# EAGLE design RWatch (EAGLE 7.3.0)
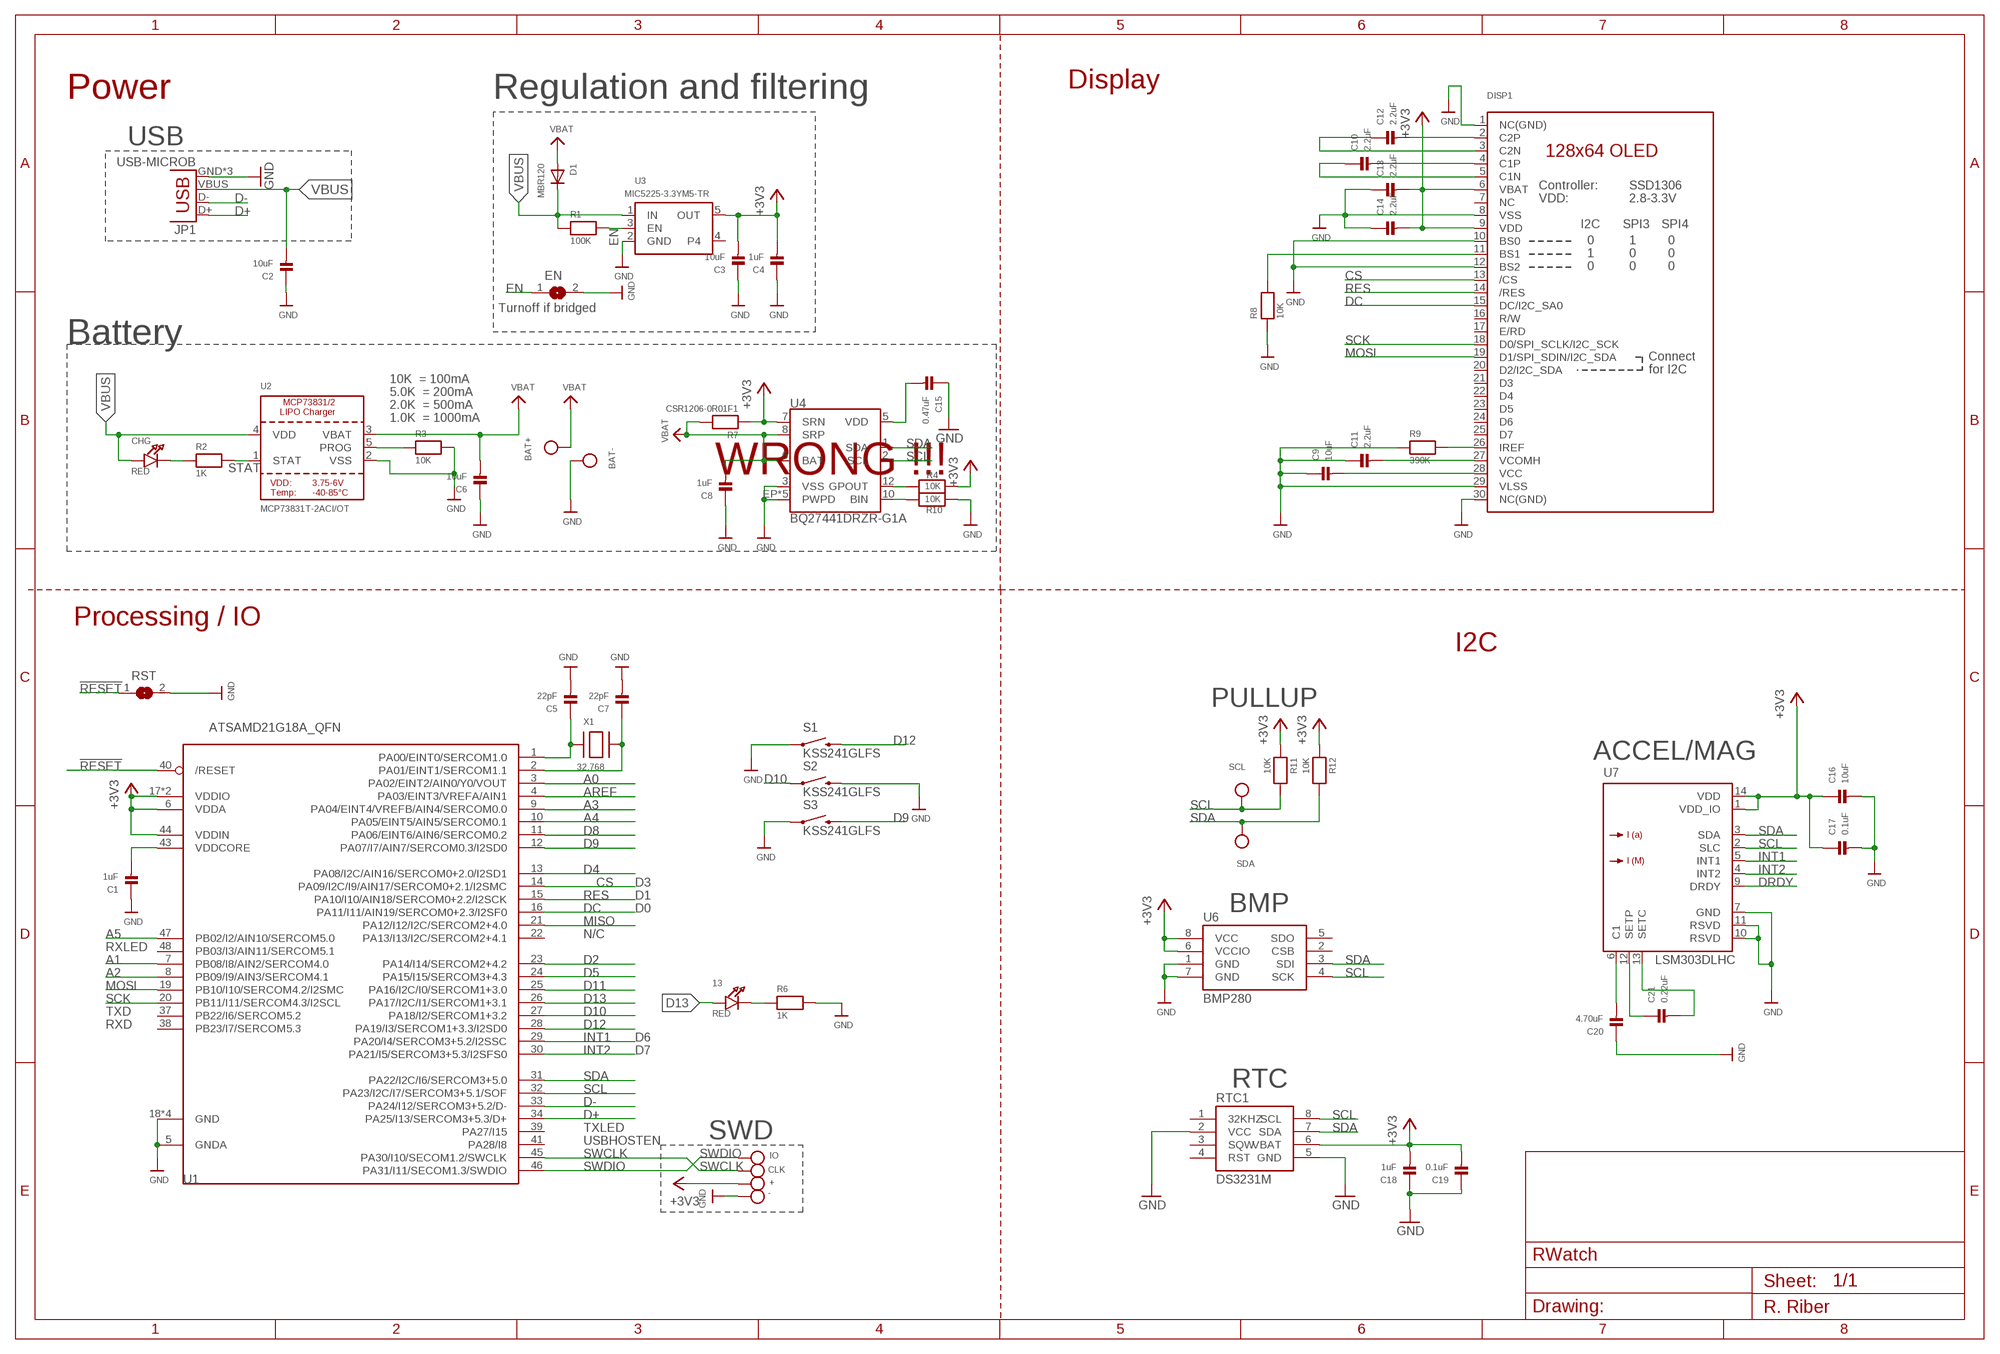
[diagram p0: schematic, sheet 1]

## Parts
13  RED  LED0805  [CHIPLED_0805]
+  TESTPOINTROUND1MM  [TESTPOINT_ROUND_1MM]
-  TESTPOINTROUND1MM  [TESTPOINT_ROUND_1MM]
BAT+  TESTPOINTROUND2MM  [TESTPOINT_ROUND_2MM]
BAT-  TESTPOINTROUND2MM  [TESTPOINT_ROUND_2MM]
C1  1uF  CAP_CERAMIC0402  [0402]
C2  10uF  CAP_CERAMIC0603  [0603]
C3  10uF  CAP_CERAMIC0603  [0603]
C4  1uF  CAP_CERAMIC0402  [0402]
C5  22pF  CAP_CERAMIC0402  [0402]
C6  10uF  CAP_CERAMIC0603  [0603]
C7  22pF  CAP_CERAMIC0402  [0402]
C8  1uF  CAP_CERAMIC0402  [0402]
C9  10uF  CAP_CERAMIC0603  [0603]
C10  2.2uF  CAP_CERAMIC0402  [0402]
C11  2.2uF  CAP_CERAMIC0402  [0402]
C12  2.2uF  CAP_CERAMIC0402  [0402]
C13  2.2uF  CAP_CERAMIC0402  [0402]
C14  2.2uF  CAP_CERAMIC0402  [0402]
C15  0.47uF  CAP_CERAMIC0402  [0402]
C16  10uF  CAP_CERAMIC0603  [0603]
C17  0.1uF  CAP_CERAMIC0402  [0402]
C18  1uF  CAP_CERAMIC0402  [0402]
C19  0.1uF  CAP_CERAMIC0402  [0402]
C20  4.70uF  CAP_CERAMIC0402  [0402]
C21  0.22uF  CAP_CERAMIC0402  [0402]
CHG  RED  LED0805  [CHIPLED_0805]
CLK  TESTPOINTROUND1MM  [TESTPOINT_ROUND_1MM]
D1  MBR120  DIODESOD-123  [SOD-123]
DISP1  DISP_OLED_UG-2864HSWEG01  [UG-2864HSWEG01_1.3_WRAPAROUND]
EN  SOLDERJUMPERREFLOW_NOPASTE  [SOLDERJUMPER_REFLOW_NOPASTE]
IO  TESTPOINTROUND1MM  [TESTPOINT_ROUND_1MM]
JP1  USB-MICROB  [USB-MICROB]
R1  100K  RESISTOR0402  [0402]
R2  1K  RESISTOR0402  [0402]
R3  10K  RESISTOR0402  [0402]
R4  10K  RESISTOR0402  [0402]
R6  1K  RESISTOR0402  [0402]
R7  CSR1206-0R01F1  RESISTOR1206  [1206]
R8  10K  RESISTOR0402  [0402]
R9  390K  RESISTOR0402  [0402]
R10  10K  RESISTOR0402  [0402]
R11  10K  RESISTOR0402  [0402]
R12  10K  RESISTOR0402  [0402]
RST  SOLDERJUMPERREFLOW_NOPASTE  [SOLDERJUMPER_REFLOW_NOPASTE]
RTC1  DS3231M  [SOIC8]
S1  KSS241GLFS  [KSS241GLFS]
S2  KSS241GLFS  [KSS241GLFS]
S3  KSS241GLFS  [KSS241GLFS]
SCL  TESTPOINTROUND1MM  [TESTPOINT_ROUND_1MM]
SDA  TESTPOINTROUND1MM  [TESTPOINT_ROUND_1MM]
U1  ATSAMD21G18A_QFN  [TQFN48_7MM]
U2  MCP73831T-2ACI/OT  MCP73831/2  [SOT23-5@1]
U3  MIC5225-3.3YM5-TR  VREG_SOT23-5  [SOT23-5]
U4  BQ27441DRZR-G1A  BQ27441-G1  [PDSO-N12]
U6  BMP280  [LGA8]
U7  LSM303DLHC  [LGA-14]
X1  32.768  XTAL-3.2X1.5  [XTAL3215]

## Nets
!RESET: RST.1 U1.40(/RESET)
+3V3: +.P$1 C3.2 C4.2 C13.2 C14.2 C16.1 C17.1 C18.2 C19.2 DISP1.6(VBAT) DISP1.9(VDD) R4.1 R7.1 R11.1 R12.1 RTC1.6(VBAT) U1.6(VDDA) U1.17(VDDIO) U1.36(VDDIO) U1.44(VDDIN) U3.5(OUT) U4.7(SRN) U6.6(VCCIO) U6.8(VCC) U7.1(VDD_IO) U7.14(VDD)
A0: U1.3(PA02/EINT2/AIN0/Y0/VOUT)
A1: U1.7(PB08/I8/AIN2/SERCOM4.0)
A2: U1.8(PB09/I9/AIN3/SERCOM4.1)
A3: U1.9(PA04/EINT4/VREFB/AIN4/SERCOM0.0)
A4: U1.10(PA05/EINT5/AIN5/SERCOM0.1)
A5: U1.47(PB02/I2/AIN10/SERCOM5.0)
AREF: U1.4(PA03/EINT3/VREFA/AIN1)
BIN: R10.2 U4.10(BIN)
CS: DISP1.13(/CS) U1.14(PA09/I2C/I9/AIN17/SERCOM0+2.1/I2SMC)
D2: U1.23(PA14/I14/SERCOM2+4.2)
D4: U1.13(PA08/I2C/AIN16/SERCOM0+2.0/I2SD1)
D5: U1.24(PA15/I15/SERCOM3+4.3)
D8: U1.11(PA06/EINT6/AIN6/SERCOM0.2)
D9: S3.2 U1.12(PA07/I7/AIN7/SERCOM0.3/I2SD0)
D10: S2.1 U1.27(PA18/I2/SERCOM1+3.2)
D11: U1.25(PA16/I2C/I0/SERCOM1+3.0)
D12: S1.2 U1.28(PA19/I3/SERCOM1+3.3/I2SD0)
D13: 13.A U1.26(PA17/I2C/I1/SERCOM1+3.1)
D+: JP1.D+ U1.34(PA25/I13/SERCOM3+5.3/D+)
D-: JP1.D- U1.33(PA24/I12/SERCOM3+5.2/D-)
DC: DISP1.15(DC/I2C_SA0) U1.16(PA11/I11/AIN19/SERCOM0+2.3/I2SF0)
DRDY: U7.9(DRDY)
EN: EN.1 R1.2 U3.3(EN)
GND: -.P$1 BAT-.P$1 C1.1 C2.1 C3.1 C4.1 C5.2 C6.1 C7.2 C8.1 C9.1 C11.1 C13.1 C14.1 C15.1 C16.2 C17.2 C18.1 C19.1 C20.1 DISP1.1(NC(GND)) DISP1.8(VSS) DISP1.10(BS0) DISP1.12(BS2) DISP1.29(VLSS) DISP1.30(NC(GND)) EN.2 JP1.GND JP1.MT1(GND) JP1.MT2(GND) R3.2 R6.2 R8.1 R9.1 R10.1 RST.2 RTC1.2(VCC) RTC1.5(GND) S1.1 S2.2 S3.1 U1.5(GNDA) U1.18(GND) U1.35(GND) U1.42(GND) U1.THERMAL(GND) U2.2(VSS) U3.2(GND) U4.3(VSS) U4.EP1(PWPD) U4.EP2(PWPD) U4.EP3(PWPD) U4.EP4(PWPD) U4.EP(PWPD) U6.1(GND) U6.7(GND) U7.7(GND) U7.10(RSVD) U7.11(RSVD)
INT1: U1.29(PA20/I4/SERCOM3+5.2/I2SSC) U7.5(INT1)
INT2: U1.30(PA21/I5/SERCOM3+5.3/I2SFS0) U7.4(INT2)
MISO: U1.21(PA12/I12/I2C/SERCOM2+4.0)
MOSI: DISP1.19(D1/SPI_SDIN/I2C_SDA) U1.19(PB10/I10/SERCOM4.2/I2SMC)
N$1: DISP1.11(BS1) R8.2
N$4: C15.2 U4.5(VDD)
N$9: C5.1 U1.1(PA00/EINT0/SERCOM1.0) X1.P$1
N$10: C7.1 U1.2(PA01/EINT1/SERCOM1.1) X1.P$2
N$11: CHG.C R2.1
N$12: C20.2 U7.6(C1)
N$13: C21.1 U7.12(SETP)
N$14: C21.2 U7.13(SETC)
N$15: R4.2 U4.12(GPOUT)
N$17: 13.C R6.1
N$34: DISP1.26(IREF) R9.2
N$35: C12.2 DISP1.2(C2P)
N$36: C12.1 DISP1.3(C2N)
N$37: C10.2 DISP1.4(C1P)
N$38: C10.1 DISP1.5(C1N)
N$39: C9.2 DISP1.28(VCC)
N$40: C11.2 DISP1.27(VCOMH)
PROG: R3.1 U2.5(PROG)
RES: DISP1.14(/RES) U1.15(PA10/I10/AIN18/SERCOM0+2.2/I2SCK)
SCK: DISP1.18(D0/SPI_SCLK/I2C_SCK) U1.20(PB11/I11/SERCOM4.3/I2SCL)
SCL: R11.2 RTC1.8(SCL) SCL.P$1 U1.32(PA23/I2C/I7/SERCOM3+5.1/SOF) U4.2(SCL) U6.4(SCK) U7.2(SLC)
SDA: R12.2 RTC1.7(SDA) SDA.P$1 U1.31(PA22/I2C/I6/SERCOM3+5.0) U4.1(SDA) U6.3(SDI) U7.3(SDA)
STAT: R2.2 U2.1(STAT)
SWCLK: CLK.P$1 U1.45(PA30/I10/SECOM1.2/SWCLK)
SWDIO: IO.P$1 U1.46(PA31/I11/SECOM1.3/SWDIO)
VBAT: BAT+.P$1 C6.2 C8.2 D1.A R7.2 U2.3(VBAT) U4.6(BAT) U4.8(SRP)
VBUS: C2.2 CHG.A D1.C JP1.VBUS R1.1 U2.4(VDD) U3.1(IN)
VDDCORE1: C1.2 U1.43(VDDCORE)
Unconnected: DISP1.7(NC) DISP1.16(R/W) DISP1.17(E/RD) DISP1.20(D2/I2C_SDA) DISP1.21(D3) DISP1.22(D4) DISP1.23(D5) DISP1.24(D6) DISP1.25(D7) RTC1.1(32KHZ) RTC1.3(SQW) RTC1.4(RST) U1.22(PA13/I13/I2C/SERCOM2+4.1) U1.37(PB22/I6/SERCOM5.2) U1.38(PB23/I7/SERCOM5.3) U1.39(PA27/I15) U1.41(PA28/I8) U1.48(PB03/I3/AIN11/SERCOM5.1) U3.4 U6.2(CSB) U6.5(SDO)

## Notes on the sheet
- Display
- Power | Regulation and filtering
- USB
- Turnoff if bridged
- Battery
- 10K  = 100mA
- 5.0K  = 200mA
- 2.0K  = 500mA
- 1.0K  = 1000mA
- WRONG !!!
- Processing / IO
- I2C
- PULLUP
- ACCEL/MAG
- D3
- D1
- D0 | BMP
- N/C
- RXLED
- TXD
- RXD
- D6
- D7
- RTC
- TXLED
- SWD
- USBHOSTEN

## Library data of the parts
13 CHG = microbuilder:LED: LED 0603 - 0603 Surface Mount Package 2mA: Green LED - Low Power (3.9mcd, 2ma, 1.7Vf) - Digikey: 475-2709-2-ND Orange LED - Low Power (9.8mcd, 2ma, 1.8Vf) - Digikey: 475-1194-2-ND Red LED - Low Power (5mcd, 2ma, 1.8Vf) - Digikey: 475-1195-2-ND Yellow LED - Low Power (7mcd, 2ma, 1.8Vf) - Digikey: 475-1196-2-ND 5mA: Blue LED - Low Power (17mcd, 5ma, 2.9Vf) - Digikey: LNJ937W8CRACT-ND 0805 - 0805 Surface Mount Package 2mA: Red LED (8.8mcd, 2mA, 1.8Vf, Clear) - Low Power [Digikey: 475-2510-1-ND] Green LED (5mcd, 2mA, 1.8Vf, Clear) - Low Power [Digikey: 475-2730-1-ND] Yellow LED (11.3mcd, 2mA, 1.8Vf, Clear) - Low Power [Digikey: 475-2555-1-ND] 20mA: Red LED (104mcd, 20mA, Diffused) - LS R976 [Digikey: 475-1278-6-ND] Red LED (12mcd, 20mA, 2.0Vf, Clear) - APT2012EC [Digikey: 754-1128-1-ND] Green LED (15mcd, 20mA, 2.2Vf, Clear) - APT2012GC [Digikey: 754-1131-1-ND] Orange LED (160mcd, 20mA, 2.1Vf, Clear) - APT2012SECK [Digikey: 754-1130-1-ND] 1206 - 1206 Surface Mount Package Green LED (26mcd, 20mA, Diffused) - LG N971 [Digikey: 475-1407-6-ND] Red LED (15mcd, 20mA, Diffused) - LH N974 [Digikey: 475-1416-6-ND]; MF: OSRAM; MPN: LGQ971; OC_FARNELL: 1226372
+ - BAT+ BAT- CLK IO SCL SDA = microbuilder:TESTPOINT: Test Point Various test points for characterisation and PCB testing TESTPOINT_SMT - Compact Surface Mount Test Point [Digikey: 5016KTR-ND]
C1-C21 = microbuilder:CAP_CERAMIC: Ceramic Capacitors 0402 - 0402 Surface Mount Capacitors 16pF 50V 5% [Digikey: 445-4899-2-ND] 18pF 50V 5% [Digikey: 490-1281-2-ND] 22pF 50V 5% [Digikey: 490-1283-2-ND] 68pF 50V 5% [Digikey: 490-1289-2-ND] 0.1uF 10V 10% [Digikey: 490-1318-2-ND] 1.0uF 6.3V 10% [Digikey: 490-1320-2-ND] 0603 - 0603 Surface Mount Capacitors 16 pF 50V 5% [Digikey: 445-5051-2-ND] 22 pF 50V [Digikey: PCC220ACVTR-ND] 33 pF 50V 5% [Digikey: 490-1415-1-ND] 56pF 50V 5% [Digikey: 490-1421-1-ND] 220pF 50V 5% [Digikey: 445-1285-1-ND] 680 pF 50V 2200 pF 50V 5% C0G [Digikey: 445-1297-1-ND] 5600 pF 100V 5% X7R [Digikey: 478-3711-1-ND] 0.1 µF 25V 10% [Digikey: PCC2277TR-ND] 0.22 µF 16V 10% X7R [Digikey: 445-1318-1-ND] 1.0 µF 25V 10% [Digikey: 445-5146-2-ND] 0603 - RF Specific 3pF 250V +/-0.1pF RF [Digikey: 712-1347-1-ND] 18 pF 250V 5% [Digikey: 478-3505-1-ND or 712-1322-1-ND] 56 pF 250V 5% C0G RF [Digikey: 490-4867-1-ND] 68 pF 250V RF [Digikey: 490-4868-1-ND] 0805 - 0805 Surface Mount Capacitors 220 pF 250V 2% RF Ceramic Capacitor [Digikey: 712-1398-1-ND] 1000 pF 50V 2% NP0 Ceramic Capacitor [Digikey: 478-3760-1-ND] 0.1 µF 25V 10% Ceramic Capacitor [Digikey: PCC1828TR-ND] 1.0 µF 16V 10% Ceramic Capacitor[Digikey: 490-1691-2-ND] 10.0 µF 10V 10% Ceramic Capacitor[Digikey: 709-1228-1-ND] 10.0 uF 16V 10% Ceramic Capacitor [Digikey: 478-5165-2-ND] 47 uF 6.3V 20% Ceramic Capacitor [Digikey: 587-1779-1-ND or 399-5506-1-ND] 1206 - 1206 Surface Mount Capacitors 47uF 10V 20% Ceramic Capacitor [Digikey: 490-5528-1-ND or 399-5508-1-ND or 445-6010-1-ND] 100uF 6.3V -20%, +80% Y5V Ceramic Capacitor (Digikey: 490-4512-1-ND, Mouser: 81-GRM31CF50J107ZE1L)
D1 = microbuilder:DIODE: Diode SMA Model Volts Amps Type Vf Vr Digikey # Notes SSA34-E3 40V 3A Schottky 480mV @ 3A 200uA @ 40V SSA34-E3/61TGITR-ND CDBA120-G 20V 1A Schottky 500mV @ 1A 500uA @ 20V 641-1014-6-ND REEL MBRA210 10V 2A Schottky 350mV @ 2A 700uA @ 10V MBRA210LT3 SOD-123 Model Volts Amps Type Vf Vr Order # Notes BAT54T1G 30V 200mA Schottky 800mV @ 200mA 2uA @ 25V BAT54T1GOSTR-ND B0530W 30V 500mA Schottky 430mV @ 500mA 130uA @ 30V B0530W-FDICT-ND REEL MBR120 1A 20V Schottky 340mV @ 1A MBR120VLSFT1GOSCT-ND SOD-323 Model Volts Amps Type Vf Vr Order # Notes PMEG2005EJ 20V 500mA Schottky 355mV @ 500mA 568-4110-1-ND ZLLS410 10V 570mA Schottky 380mV @ 570mA ZLLS410CT-ND 1N4148WS 75V 150mA Silicon/Simple 1V 1N4148WSFSCT-ND REEL SOD-523 Model Volts Amps Type Vf Vr Order # Notes BAT54XV2 30V 200mA Schottky 0.8V @ 100mA BAT54XV2CT-ND TB751S 30V 30mA Schottky RB751S-40TE61CT-ND SOT23-R/W (R = Solder Paste/Reflow Ovens, W = Hand-Soldering) Model Volts Amps Type Vf Vr Order # Notes BAT54FILM 40V 300mA Schottky 497-7162-1-ND; MF: ON SEMICONDUCTOR; MPN: MBR120VLSFT1G; OC_FARNELL: 1431044
DISP1 = microbuilder:DISP_OLED_UG-2864HSWEG01: UG-2864HSWEG01 OLED display Both 1.3" and 0.96" models share the same FPC tab footprint, only the screen dimensions vary.
EN RST = microbuilder:SOLDERJUMPER: SMD Solder JUMPER Solder the two pads together to create a connection, or remove the solder to break it. REFLOW - Use this footprint for solder paste and reflow ovens. WAVE - Use this footprint for hand-soldering (larger pads). CLOSED - Has a trace between the two pads to ensure it is closed by default. The trace needs to be cut to disable the jumper, and can be closed again by creating a solder bridge between the two pads.
JP1 = SparkFun-Connectors:USB: USB Connectors USB-B-PTH is fully proven SKU : PRT-00139/CONN-08278 USB-miniB is fully proven SKU : PRT-00587 USB-A-PCB is untested. USB-A-H is throughly reviewed, but untested. Spark Fun Electronics SKU : PRT-00437 USB-B-SMT is throughly reviewed, but untested. Needs silkscreen touching up. USB-A-S has not been used/tested USB-MB-H has not been used/tested USB-MICROB has been used. CONN-09505; MF: FCI; MPN: 10104110-0001LF; OC_FARNELL: 2293753; PROD_ID: CONN-09505
R1 R2 = microbuilder:RESISTOR: Resistors 0402 - 0402 Surface Mount Package 22 Ohm 1% 1/16W [Digikey: 311-22.0LRTR-ND] 33 Ohm 5% 1/16W 1.0K 5% 1/16W 1.5K 5% 1/16W 2.0K 1% 1/16W 10.0K 1% 1/16W [Digikey: 311-10.0KLRTR-ND] 10.0K 5% 1/16W [Digikey: RMCF0402JT10K0TR-ND] 12.1K 1% 1/16W [Digikey: 311-22.0LRTR-ND] 100.0K 5% 1/16W 0603 - 0603 Surface Mount Package 0 Ohm 1/10 Watt 1% Resistor 15 Ohm 1/10 Watt 1% Resistor 33 Ohm 1/10 Watt 1% Resistor 49.9 Ohm 1/10 Watt 1% Resistor 100 Ohm 1/10 Watt 1% Resistor 150 Ohm 1/10 Watt 1% Resistor 240 Ohm 1/10 Watt 1% Resistor 390 Ohm 1/10 Watt 1% Resistor 560 Ohm 1/10 Watt 1% Resistor 680 Ohm 1/10 Watt 1% Resistor 750 Ohm 1/10 Watt 1% Resistor 1.0K Ohm 1/10 Watt 1% Resistor 1.5K Ohm 1/10 Watt 1% Resistor 2.0K Ohm 1/10 Watt 1% Resistor 2.2K Ohm 1/10 Watt 1% Resistor 3.3K Ohm 1/10 Watt 1% Resistor 4.7K Ohm 1/10 Watt 1% Resistor 10.0K Ohm 1/10 Watt 1% Resistor 12.0K Ohm 1/10 Watt 1% Resistor 12.1K Ohm 1/10 Watt 1% Resistor 20.0K Ohm 1/10 Watt 1% Resistor 33.0K Ohm 1/10 Watt 1% Resistor 100.0K Ohm 1/10 Watt 1% Resistor 0805 - 0805 Surface Mount Package 0 Ohm 1/8 Watt 1% Resistor 33 Ohm 1/8 Watt 1% Resistor 100 Ohm 1/8 Watt 1% Resistor 150 Ohm 1/8 Watt 1% Resistor 200 Ohm 1/8 Watt 1% Resistor 240 Ohm 1/8 Watt 1% Resistor 330 Ohm 1/8 Watt 1% Resistor 390 Ohm 1/8 Watt 1% Resistor 470 Ohm 1/8 Watt 1% Resistor 1.0K Ohm 1/8 Watt 1% Resistor 1.5K Ohm 1/8 Watt 1% Resistor 2.0K Ohm 1/8 Watt 1% Resistor 4.7K Ohm 1/8 Watt 1% Resistor 5.1K Ohm 1/8 Watt 1% Resistor 5.6K Ohm 1/8 Watt 1% Resistor 10.0K Ohm 1/8 Watt 1% Resistor 22.0K Ohm 1/8 Watt 1% Resistor 33.0K Ohm 1/8 Watt 1% Resistor 100K Ohm 1/8 Watt 1% Resistor 1206 - 1206 Surface Mount Package 2012 - 2010 Surface Mount Package 0.11 Ohm 1/2 Watt 1% Resistor - Digikey: RHM.11UCT-ND; MF: MULTICOMP; MPN: MC0063W06031221R; OC_FARNELL: 1170720
R3 = microbuilder:RESISTOR: Resistors 0402 - 0402 Surface Mount Package 22 Ohm 1% 1/16W [Digikey: 311-22.0LRTR-ND] 33 Ohm 5% 1/16W 1.0K 5% 1/16W 1.5K 5% 1/16W 2.0K 1% 1/16W 10.0K 1% 1/16W [Digikey: 311-10.0KLRTR-ND] 10.0K 5% 1/16W [Digikey: RMCF0402JT10K0TR-ND] 12.1K 1% 1/16W [Digikey: 311-22.0LRTR-ND] 100.0K 5% 1/16W 0603 - 0603 Surface Mount Package 0 Ohm 1/10 Watt 1% Resistor 15 Ohm 1/10 Watt 1% Resistor 33 Ohm 1/10 Watt 1% Resistor 49.9 Ohm 1/10 Watt 1% Resistor 100 Ohm 1/10 Watt 1% Resistor 150 Ohm 1/10 Watt 1% Resistor 240 Ohm 1/10 Watt 1% Resistor 390 Ohm 1/10 Watt 1% Resistor 560 Ohm 1/10 Watt 1% Resistor 680 Ohm 1/10 Watt 1% Resistor 750 Ohm 1/10 Watt 1% Resistor 1.0K Ohm 1/10 Watt 1% Resistor 1.5K Ohm 1/10 Watt 1% Resistor 2.0K Ohm 1/10 Watt 1% Resistor 2.2K Ohm 1/10 Watt 1% Resistor 3.3K Ohm 1/10 Watt 1% Resistor 4.7K Ohm 1/10 Watt 1% Resistor 10.0K Ohm 1/10 Watt 1% Resistor 12.0K Ohm 1/10 Watt 1% Resistor 12.1K Ohm 1/10 Watt 1% Resistor 20.0K Ohm 1/10 Watt 1% Resistor 33.0K Ohm 1/10 Watt 1% Resistor 100.0K Ohm 1/10 Watt 1% Resistor 0805 - 0805 Surface Mount Package 0 Ohm 1/8 Watt 1% Resistor 33 Ohm 1/8 Watt 1% Resistor 100 Ohm 1/8 Watt 1% Resistor 150 Ohm 1/8 Watt 1% Resistor 200 Ohm 1/8 Watt 1% Resistor 240 Ohm 1/8 Watt 1% Resistor 330 Ohm 1/8 Watt 1% Resistor 390 Ohm 1/8 Watt 1% Resistor 470 Ohm 1/8 Watt 1% Resistor 1.0K Ohm 1/8 Watt 1% Resistor 1.5K Ohm 1/8 Watt 1% Resistor 2.0K Ohm 1/8 Watt 1% Resistor 4.7K Ohm 1/8 Watt 1% Resistor 5.1K Ohm 1/8 Watt 1% Resistor 5.6K Ohm 1/8 Watt 1% Resistor 10.0K Ohm 1/8 Watt 1% Resistor 22.0K Ohm 1/8 Watt 1% Resistor 33.0K Ohm 1/8 Watt 1% Resistor 100K Ohm 1/8 Watt 1% Resistor 1206 - 1206 Surface Mount Package 2012 - 2010 Surface Mount Package 0.11 Ohm 1/2 Watt 1% Resistor - Digikey: RHM.11UCT-ND; MF: VISHAY; MPN: CRCW060310K0JNEA; OC_FARNELL: 1469749
R4 R10-R12 = microbuilder:RESISTOR: Resistors 0402 - 0402 Surface Mount Package 22 Ohm 1% 1/16W [Digikey: 311-22.0LRTR-ND] 33 Ohm 5% 1/16W 1.0K 5% 1/16W 1.5K 5% 1/16W 2.0K 1% 1/16W 10.0K 1% 1/16W [Digikey: 311-10.0KLRTR-ND] 10.0K 5% 1/16W [Digikey: RMCF0402JT10K0TR-ND] 12.1K 1% 1/16W [Digikey: 311-22.0LRTR-ND] 100.0K 5% 1/16W 0603 - 0603 Surface Mount Package 0 Ohm 1/10 Watt 1% Resistor 15 Ohm 1/10 Watt 1% Resistor 33 Ohm 1/10 Watt 1% Resistor 49.9 Ohm 1/10 Watt 1% Resistor 100 Ohm 1/10 Watt 1% Resistor 150 Ohm 1/10 Watt 1% Resistor 240 Ohm 1/10 Watt 1% Resistor 390 Ohm 1/10 Watt 1% Resistor 560 Ohm 1/10 Watt 1% Resistor 680 Ohm 1/10 Watt 1% Resistor 750 Ohm 1/10 Watt 1% Resistor 1.0K Ohm 1/10 Watt 1% Resistor 1.5K Ohm 1/10 Watt 1% Resistor 2.0K Ohm 1/10 Watt 1% Resistor 2.2K Ohm 1/10 Watt 1% Resistor 3.3K Ohm 1/10 Watt 1% Resistor 4.7K Ohm 1/10 Watt 1% Resistor 10.0K Ohm 1/10 Watt 1% Resistor 12.0K Ohm 1/10 Watt 1% Resistor 12.1K Ohm 1/10 Watt 1% Resistor 20.0K Ohm 1/10 Watt 1% Resistor 33.0K Ohm 1/10 Watt 1% Resistor 100.0K Ohm 1/10 Watt 1% Resistor 0805 - 0805 Surface Mount Package 0 Ohm 1/8 Watt 1% Resistor 33 Ohm 1/8 Watt 1% Resistor 100 Ohm 1/8 Watt 1% Resistor 150 Ohm 1/8 Watt 1% Resistor 200 Ohm 1/8 Watt 1% Resistor 240 Ohm 1/8 Watt 1% Resistor 330 Ohm 1/8 Watt 1% Resistor 390 Ohm 1/8 Watt 1% Resistor 470 Ohm 1/8 Watt 1% Resistor 1.0K Ohm 1/8 Watt 1% Resistor 1.5K Ohm 1/8 Watt 1% Resistor 2.0K Ohm 1/8 Watt 1% Resistor 4.7K Ohm 1/8 Watt 1% Resistor 5.1K Ohm 1/8 Watt 1% Resistor 5.6K Ohm 1/8 Watt 1% Resistor 10.0K Ohm 1/8 Watt 1% Resistor 22.0K Ohm 1/8 Watt 1% Resistor 33.0K Ohm 1/8 Watt 1% Resistor 100K Ohm 1/8 Watt 1% Resistor 1206 - 1206 Surface Mount Package 2012 - 2010 Surface Mount Package 0.11 Ohm 1/2 Watt 1% Resistor - Digikey: RHM.11UCT-ND; MF: VISHAY; MPN: CRCW060310K0FKEA; OC_FARNELL: 1469748
R6 = microbuilder:RESISTOR: Resistors 0402 - 0402 Surface Mount Package 22 Ohm 1% 1/16W [Digikey: 311-22.0LRTR-ND] 33 Ohm 5% 1/16W 1.0K 5% 1/16W 1.5K 5% 1/16W 2.0K 1% 1/16W 10.0K 1% 1/16W [Digikey: 311-10.0KLRTR-ND] 10.0K 5% 1/16W [Digikey: RMCF0402JT10K0TR-ND] 12.1K 1% 1/16W [Digikey: 311-22.0LRTR-ND] 100.0K 5% 1/16W 0603 - 0603 Surface Mount Package 0 Ohm 1/10 Watt 1% Resistor 15 Ohm 1/10 Watt 1% Resistor 33 Ohm 1/10 Watt 1% Resistor 49.9 Ohm 1/10 Watt 1% Resistor 100 Ohm 1/10 Watt 1% Resistor 150 Ohm 1/10 Watt 1% Resistor 240 Ohm 1/10 Watt 1% Resistor 390 Ohm 1/10 Watt 1% Resistor 560 Ohm 1/10 Watt 1% Resistor 680 Ohm 1/10 Watt 1% Resistor 750 Ohm 1/10 Watt 1% Resistor 1.0K Ohm 1/10 Watt 1% Resistor 1.5K Ohm 1/10 Watt 1% Resistor 2.0K Ohm 1/10 Watt 1% Resistor 2.2K Ohm 1/10 Watt 1% Resistor 3.3K Ohm 1/10 Watt 1% Resistor 4.7K Ohm 1/10 Watt 1% Resistor 10.0K Ohm 1/10 Watt 1% Resistor 12.0K Ohm 1/10 Watt 1% Resistor 12.1K Ohm 1/10 Watt 1% Resistor 20.0K Ohm 1/10 Watt 1% Resistor 33.0K Ohm 1/10 Watt 1% Resistor 100.0K Ohm 1/10 Watt 1% Resistor 0805 - 0805 Surface Mount Package 0 Ohm 1/8 Watt 1% Resistor 33 Ohm 1/8 Watt 1% Resistor 100 Ohm 1/8 Watt 1% Resistor 150 Ohm 1/8 Watt 1% Resistor 200 Ohm 1/8 Watt 1% Resistor 240 Ohm 1/8 Watt 1% Resistor 330 Ohm 1/8 Watt 1% Resistor 390 Ohm 1/8 Watt 1% Resistor 470 Ohm 1/8 Watt 1% Resistor 1.0K Ohm 1/8 Watt 1% Resistor 1.5K Ohm 1/8 Watt 1% Resistor 2.0K Ohm 1/8 Watt 1% Resistor 4.7K Ohm 1/8 Watt 1% Resistor 5.1K Ohm 1/8 Watt 1% Resistor 5.6K Ohm 1/8 Watt 1% Resistor 10.0K Ohm 1/8 Watt 1% Resistor 22.0K Ohm 1/8 Watt 1% Resistor 33.0K Ohm 1/8 Watt 1% Resistor 100K Ohm 1/8 Watt 1% Resistor 1206 - 1206 Surface Mount Package 2012 - 2010 Surface Mount Package 0.11 Ohm 1/2 Watt 1% Resistor - Digikey: RHM.11UCT-ND; MF: VISHAY; MPN: CRCW06032K20JNEA; OC_FARNELL: 1652868
R7-R9 = microbuilder:RESISTOR: Resistors 0402 - 0402 Surface Mount Package 22 Ohm 1% 1/16W [Digikey: 311-22.0LRTR-ND] 33 Ohm 5% 1/16W 1.0K 5% 1/16W 1.5K 5% 1/16W 2.0K 1% 1/16W 10.0K 1% 1/16W [Digikey: 311-10.0KLRTR-ND] 10.0K 5% 1/16W [Digikey: RMCF0402JT10K0TR-ND] 12.1K 1% 1/16W [Digikey: 311-22.0LRTR-ND] 100.0K 5% 1/16W 0603 - 0603 Surface Mount Package 0 Ohm 1/10 Watt 1% Resistor 15 Ohm 1/10 Watt 1% Resistor 33 Ohm 1/10 Watt 1% Resistor 49.9 Ohm 1/10 Watt 1% Resistor 100 Ohm 1/10 Watt 1% Resistor 150 Ohm 1/10 Watt 1% Resistor 240 Ohm 1/10 Watt 1% Resistor 390 Ohm 1/10 Watt 1% Resistor 560 Ohm 1/10 Watt 1% Resistor 680 Ohm 1/10 Watt 1% Resistor 750 Ohm 1/10 Watt 1% Resistor 1.0K Ohm 1/10 Watt 1% Resistor 1.5K Ohm 1/10 Watt 1% Resistor 2.0K Ohm 1/10 Watt 1% Resistor 2.2K Ohm 1/10 Watt 1% Resistor 3.3K Ohm 1/10 Watt 1% Resistor 4.7K Ohm 1/10 Watt 1% Resistor 10.0K Ohm 1/10 Watt 1% Resistor 12.0K Ohm 1/10 Watt 1% Resistor 12.1K Ohm 1/10 Watt 1% Resistor 20.0K Ohm 1/10 Watt 1% Resistor 33.0K Ohm 1/10 Watt 1% Resistor 100.0K Ohm 1/10 Watt 1% Resistor 0805 - 0805 Surface Mount Package 0 Ohm 1/8 Watt 1% Resistor 33 Ohm 1/8 Watt 1% Resistor 100 Ohm 1/8 Watt 1% Resistor 150 Ohm 1/8 Watt 1% Resistor 200 Ohm 1/8 Watt 1% Resistor 240 Ohm 1/8 Watt 1% Resistor 330 Ohm 1/8 Watt 1% Resistor 390 Ohm 1/8 Watt 1% Resistor 470 Ohm 1/8 Watt 1% Resistor 1.0K Ohm 1/8 Watt 1% Resistor 1.5K Ohm 1/8 Watt 1% Resistor 2.0K Ohm 1/8 Watt 1% Resistor 4.7K Ohm 1/8 Watt 1% Resistor 5.1K Ohm 1/8 Watt 1% Resistor 5.6K Ohm 1/8 Watt 1% Resistor 10.0K Ohm 1/8 Watt 1% Resistor 22.0K Ohm 1/8 Watt 1% Resistor 33.0K Ohm 1/8 Watt 1% Resistor 100K Ohm 1/8 Watt 1% Resistor 1206 - 1206 Surface Mount Package 2012 - 2010 Surface Mount Package 0.11 Ohm 1/2 Watt 1% Resistor - Digikey: RHM.11UCT-ND
RTC1 = SparkFun-DigitalIC:DS3231M: DS3231M Real Time Clock. Accuracy +/-5ppm. Battery Backup. 2.3V to 5.5V.; MF: MAXIM INTEGRATED PRODUCTS; MPN: DS3231MZ+TRL; OC_FARNELL: 2515487; PROD_ID: IC-11985
S1-S3 = Rafael's Library:KSS241GLFS
U1 = Rafael's Library:ATSAMD21G18A
U2 = microbuilder:MCP73831/2: MCP73831/2 LIPO Charger VDD: 3.75 - 6V Temp -40 - 85°C Programmable Charge Rate: 15-500mA NOTE: STAT is a tri-state logic output on the MCP73831 and an open-drain output on the MCP73832. SOT23-5 with 4.2V output and tri-state logic on STAT = MCP73831T-2ACI/OT; MF: MICROCHIP; MPN: MCP73831T-2ACI/OT; OC_FARNELL: 1332158
U3 = microbuilder:VREG_SOT23-5: SOT23-5 Fixed Voltage Regulators To better organise some of the SOT23-5 fixed voltage regulators in this library, this new part was created. Part Current Out V Out V In V Dropout Digikey Part No. ADP121 150mA 3.3V 3.4-5.5V 0.09V @ 150mA ADP121-AUJZ33R7CT-ND ADP121 150mA 3.0V 3.1-5.5V 0.09V @ 150mA ADP121-AUJZ30R7CT-ND ADP122 300mA 3.3V 3.4-5.5V 0.085V @ 300mA ADP122AUJZ-3.3-R7CT-ND ADP1712 300mA 3.3V 3.5-5.5V 0.17V @ 300mA ADP1712AUJZ-3.3-R7TR-ND AP7311 (Low Cost) 150mA 3.3V 3.5-6V 0.15V @ 150mA AP7311-33WG-7DICT-ND LD39015M18R 150mA 1.8V 1.9V-5.5V 0.08V @ 100mA 497-6977-1-ND MCP1824T-3302E/OT 300mA 3.3V 3.5V-6V 0.2V @ 300mA MCP1824T-3302E/OTCT-ND MIC5205-2.5YM5 TR 150mA 2.5V 2.7-16V 0.165V @ 150mA 576-1257-2-ND MIC5205-3.0YM5 TR 150mA 3.0V 3.2V-16V 0.165V @ 150mA 576-1258-2-ND MIC5205-3.3YM5 TR 150mA 3.3V 3.5V-16V 0.165V @ 150mA 576-1259-2-ND TPS780330220 150mA 3.3V+2.2V 3.6-5.5V 250mV Max 296-23332-1-ND TDA3663/N1,135 100mA 3.3V 3.5-45V 0.18V @ 50mA 568-5343-1-ND; MF: MICROCHIP; MPN: MIC5225-3.3YM5-TR; OC_FARNELL: 2510262
U4 = SparkFun-PowerIC:BQ27441-G1: Texas Instruments BQ27441-G1 LiPo Battery Fuel Gauge The Texas Instruments bq27441-G1 fuel gauge is a microcontroller peripheral that provides system-side fuel gauging for single-cell Li-Ion batteries. The device requires minimal user configuration and system microcontroller firmware development. The bq27441-G1 battery fuel gauge uses the patented Impedance Track™ algorithm for fuel gauging, and provides information such as remaining battery capacity (mAh), state-of-charge (%), and battery voltage (mV). Datasheet <http://www.ti.com/product/BQ27441-G1/datasheet> SparkFun Products SparkFun Battery Babysitter <https://www.sparkfun.com/products/13777> (PRT-13777); PROD_ID: IC-13220
U6 = we-sensor:BMP280: Bosch BMP280 Pressure Sensor
U7 = st-microelectronics:LSM303DLHC: Ultra compact high performance e-compass, 3D accelerometer and 3D magnetometer module Source: DM00027543-118326.pdf
X1 = adafruit2:XTAL: Low cost SMT crystals, no capacitors included http://www.ladyada.net/library/eagle

## Board
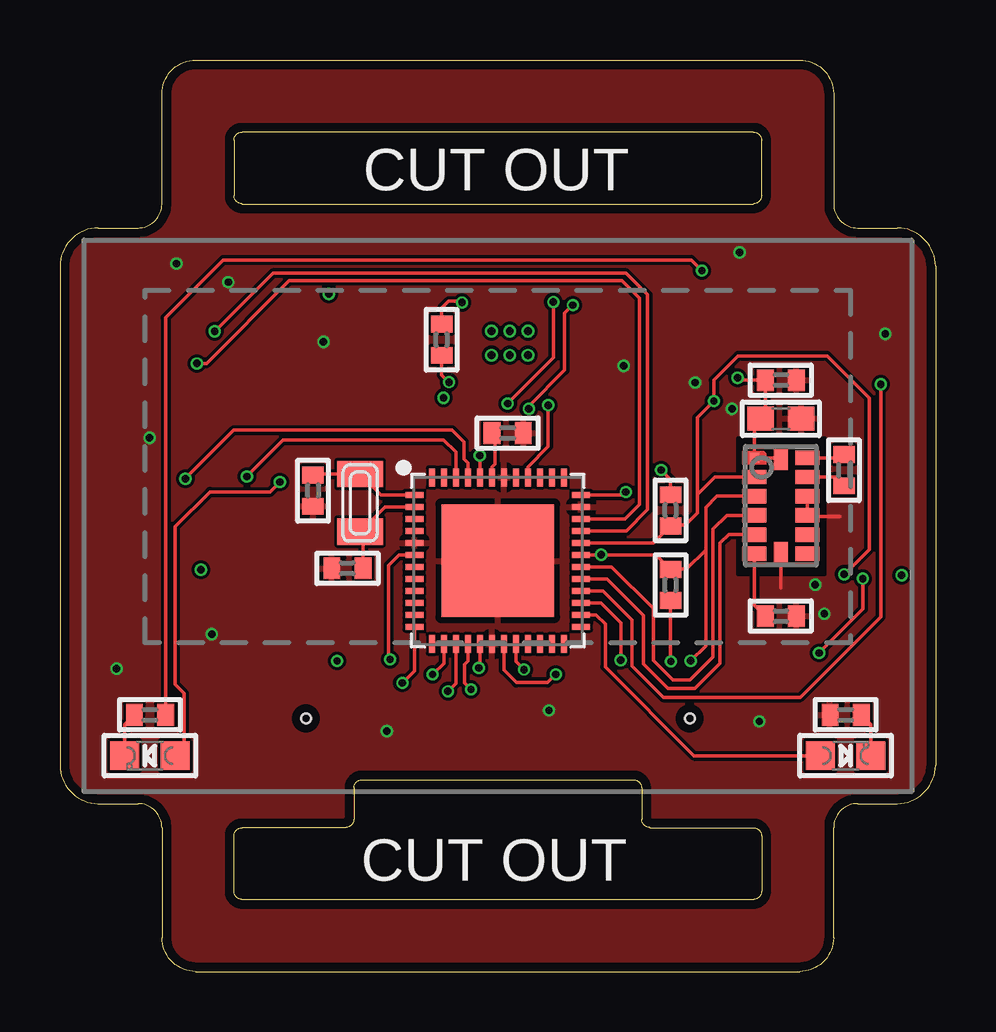
[diagram p1: board, top side]
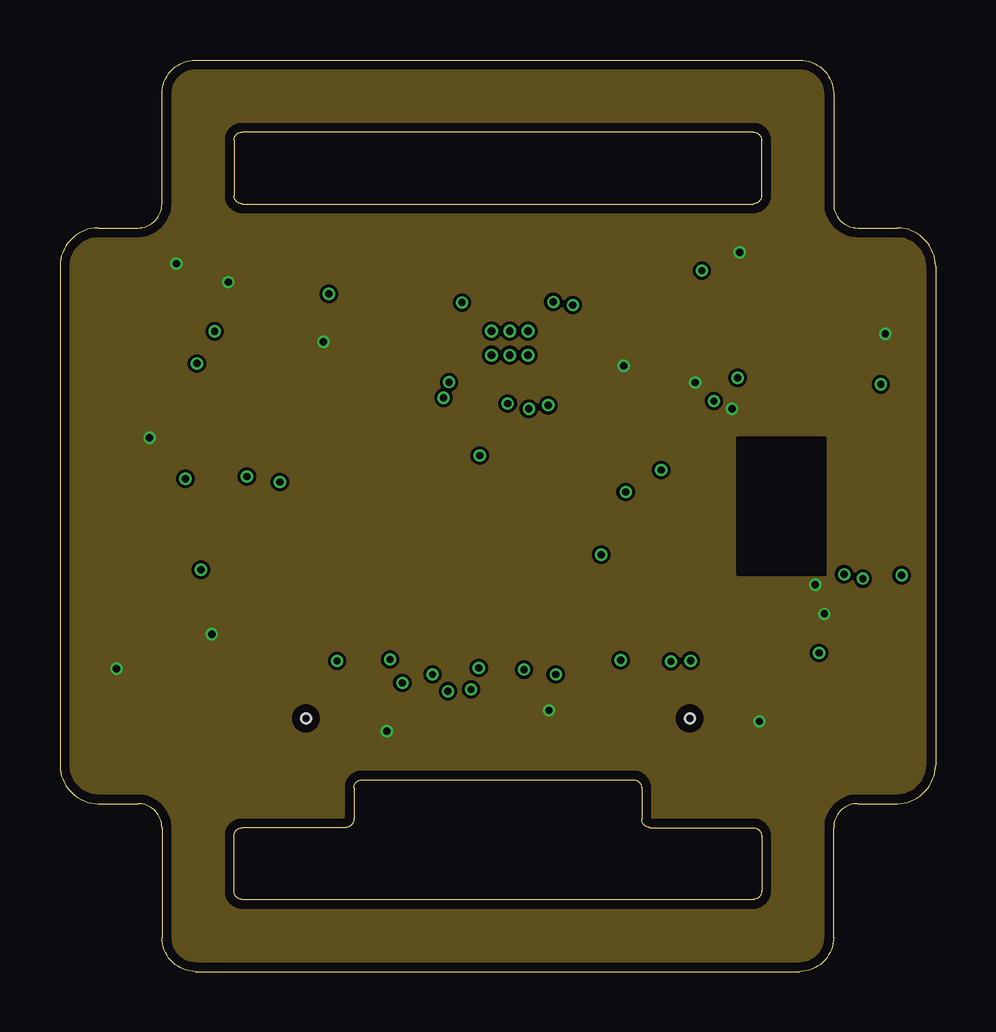
[diagram p2: board, inner layer Route2]
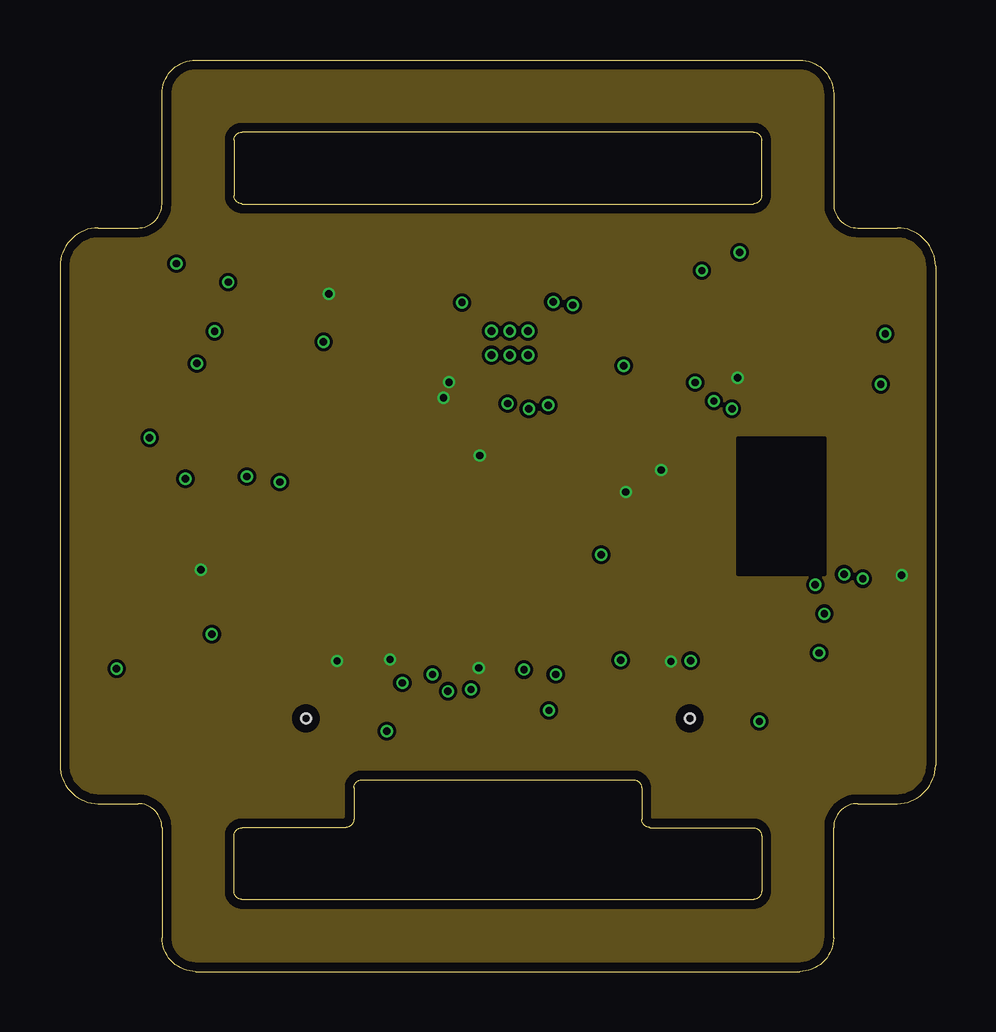
[diagram p3: board, inner layer Route15]
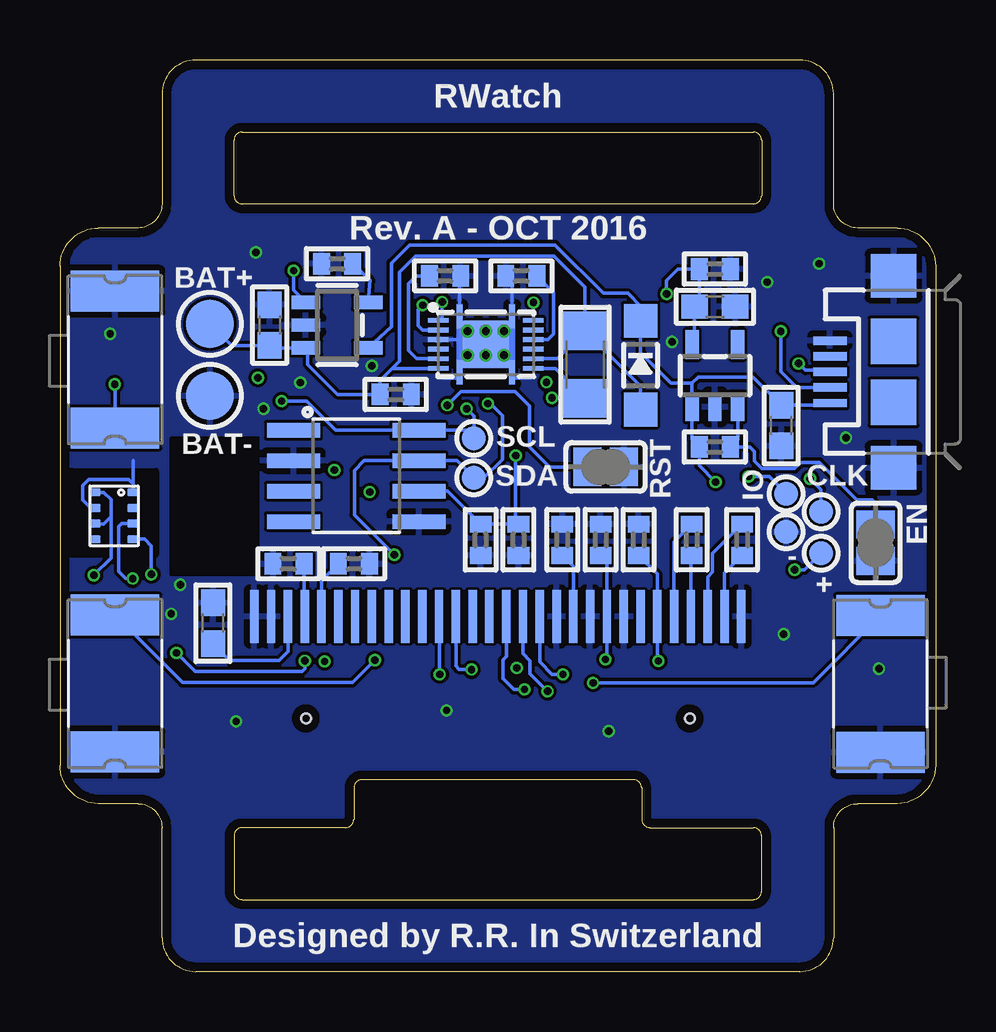
[diagram p4: board, bottom side, seen from below]

Size 36.5 x 38 mm. Coordinates in mm from the lower left corner, seen from the top.
Outline: 0,29.4 0,8.6 arc90 1.6,7 3.25,7 arc-90 4.25,6 4.25,1.41 arc90 5.66,0 30.84,0 arc90 32.25,1.41 32.25,6 arc-90 33.25,7 34.9,7 arc90 36.5,8.6 36.5,29.4 arc90 34.9,31 33.25,31 arc-90 32.25,32 32.25,36.59 arc90 30.84,38 5.66,38 arc90 4.25,36.59 4.25,32 arc-90 3.25,31 1.6,31 arc90 0,29.4
Outline: 28.9,6 arc-90 29.25,5.65 29.25,3.35 arc-90 28.9,3 7.6,3 arc-90 7.25,3.35 7.25,5.65 arc-90 7.6,6 11.9,6 arc90 12.25,6.35 12.25,7.65 arc-90 12.6,8 23.9,8 arc-90 24.25,7.65 24.25,6.35 arc90 24.6,6 28.9,6
Outline: 29.25,32.35 29.25,34.65 arc90 28.9,35 7.6,35 arc90 7.25,34.65 7.25,32.35 arc90 7.6,32 28.9,32 arc90 29.25,32.35
Copper layers (1*2*15*16): Top 0.035559375mm / dielectric 0.17018125mm / Route2 0.01778125mm / dielectric 47mil / Route15 0.01778125mm / dielectric 0.17018125mm / Bottom 0.035559375mm
Design rules "OSHPark-4layer-tented": minimum track width 5mil, minimum drill 10mil, track to track 5mil, track to pad 5mil, pad to pad 5mil, via to via 5mil, smd to smd 5mil, copper to edge 15mil, drill to drill 6mil, minimum pad ring 4mil, minimum via ring 4mil, stop-mask expansion 2.5mil, vias tented up to drill 12mil, thermal gap 10mil
tRestrict: area 28.2,16.6 to 31.9,22.2
bRestrict: area 32.5,17.4 to 36,20.9; area 28.2,16.6 to 31.9,22.2

### Footprints (pad centres in the part's own frame; a part is rotated, then mirrored left to right if it is on the bottom)
CHIPLED_0805 = smd 1.2 x 1.2: A 0,-1.05; C 0,1.05
TESTPOINT_ROUND_1MM = smd 1 x 1: P$1 0,0
TESTPOINT_ROUND_2MM = smd 2 x 2: P$1 0,0
0402 = smd 0.7 x 0.9: 1 -0.65,0; 2 0.65,0
0603 = smd 1.1 x 1: 1 -0.85,0; 2 0.85,0
SOD-123 = smd 1.4 x 1.4: A 1.85,0; C -1.85,0
UG-2864HSWEG01_1.3_WRAPAROUND = smd 0.35 x 2.2 bottom: 1 -10.15,-0.2; 2 -9.45,-0.2; 3 -8.75,-0.2; 4 -8.05,-0.2; 5 -7.35,-0.2; 6 -6.65,-0.2; 7 -5.95,-0.2; 8 -5.25,-0.2; 9 -4.55,-0.2; 10 -3.85,-0.2; 11 -3.15,-0.2; 12 -2.45,-0.2; 13 -1.75,-0.2; 14 -1.05,-0.2; 15 -0.35,-0.2; 16 0.35,-0.2; 17 1.05,-0.2; 18 1.75,-0.2; 19 2.45,-0.2; 20 3.15,-0.2; 21 3.85,-0.2; 22 4.55,-0.2; 23 5.25,-0.2; 24 5.95,-0.2; 25 6.65,-0.2; 26 7.35,-0.2; 27 8.05,-0.2; 28 8.75,-0.2; 29 9.45,-0.2; 30 10.15,-0.2 | hole 0.4: -8,-4.45; 8,-4.45
SOLDERJUMPER_REFLOW_NOPASTE = smd 1.168 x 1.6: 1 -0.762,0; 2 0.762,0
USB-MICROB = smd 0.35 x 1.4: D+ 0,2.65; D- -0.65,2.65; GND 1.3,2.65; ID 0.65,2.65; VBUS -1.3,2.65 | smd 1.8 x 1.9: MT1 -4,0; MT2 4,0 | smd 1.9 x 1.9: P$1 -1.27,0; P$2 1.27,0
1206 = smd 1.6 x 1.8: 1 -1.4,0; 2 1.4,0
SOIC8 = smd 0.61 x 2.21: 1 -1.905,-2.616; 2 -0.635,-2.616; 3 0.635,-2.616; 4 1.905,-2.616; 5 1.905,2.616; 6 0.635,2.616; 7 -0.635,2.616; 8 -1.905,2.616
KSS241GLFS = smd 1.7 x 3.7: 1 -2.86,0.045; 2 2.84,0.045
TQFN48_7MM = smd 0.25 x 0.75: 1 -2.75,-3.475; 2 -2.25,-3.475; 3 -1.75,-3.475; 4 -1.25,-3.475; 5 -0.75,-3.475; 6 -0.25,-3.475; 7 0.25,-3.475; 8 0.75,-3.475; 9 1.25,-3.475; 10 1.75,-3.475; 11 2.25,-3.475; 12 2.75,-3.475; 25 2.75,3.475; 26 2.25,3.475; 27 1.75,3.475; 28 1.25,3.475; 29 0.75,3.475; 30 0.25,3.475; 31 -0.25,3.475; 32 -0.75,3.475; 33 -1.25,3.475; 34 -1.75,3.475; 35 -2.25,3.475; 36 -2.75,3.475 | smd 0.75 x 0.25: 13 3.475,-2.75; 14 3.475,-2.25; 15 3.475,-1.75; 16 3.475,-1.25; 17 3.475,-0.75; 18 3.475,-0.25; 19 3.475,0.25; 20 3.475,0.75; 21 3.475,1.25; 22 3.475,1.75; 23 3.475,2.25; 24 3.475,2.75; 37 -3.475,2.75; 38 -3.475,2.25; 39 -3.475,1.75; 40 -3.475,1.25; 41 -3.475,0.75; 42 -3.475,0.25; 43 -3.475,-0.25; 44 -3.475,-0.75; 45 -3.475,-1.25; 46 -3.475,-1.75; 47 -3.475,-2.25; 48 -3.475,-2.75 | smd 4.7 x 4.7: THERMAL 0,0
SOT23-5@1 = smd 0.55 x 1.2: 1 -0.95,-1.3; 2 0,-1.3; 3 0.95,-1.3; 4 0.95,1.3; 5 -0.95,1.3
SOT23-5 = smd 0.55 x 1.2: 1 -0.95,-1.3; 2 0,-1.3; 3 0.95,-1.3; 4 0.95,1.3; 5 -0.95,1.3
PDSO-N12 = smd 0.2 x 0.85: 1 -1,-1.975; 2 -0.6,-1.975; 3 -0.2,-1.975; 4 0.2,-1.975; 5 0.6,-1.975; 6 1,-1.975; 7 1,1.975; 8 0.6,1.975; 9 0.2,1.975; 10 -0.2,1.975; 11 -0.6,1.975; 12 -1,1.975 | smd 1.95 x 1.95: EP 0,0 | smd 1 x 0.25: EP1 -1.15,1.1; EP2 -1.15,-1.1; EP3 1.15,-1.1; EP4 1.15,1.1
LGA8 = smd 0.5 x 0.35: 1 0.8,0.975; 2 0.8,0.325; 3 0.8,-0.325; 4 0.8,-0.975; 5 -0.8,-0.975; 6 -0.8,-0.325; 7 -0.8,0.325; 8 -0.8,0.975
LGA-14 = smd 0.4 x 0.4: 1 -2,-1.1 | smd 0.6 x 1: 2 -1.2,-1.1; 3 -0.4,-1.1; 4 0.4,-1.1; 5 1.2,-1.1; 6 2,-1.1; 8 2,1.1; 9 1.2,1.1; 10 0.4,1.1; 11 -0.4,1.1; 12 -1.2,1.1; 13 -2,1.1 | smd 1 x 0.6: 7 2,0; 14 -2,0
XTAL3215 = smd 1.1 x 1.9: P$1 1.2,0; P$2 -1.2,0

### Placement (x,y rotation side)
13  32.75,9 270 top
+  4.78,17.44 270 bottom
-  6.22,18.33 180 bottom
BAT+  30.25,27 90 bottom
BAT-  30.25,24 0 bottom
C1  18.66,22.45 180 top
C2  6.44,22.76 90 bottom
C3  9.2,27.71 180 bottom
C4  9.2,29.28 180 bottom
C5  10.55,20.05 270 top
C6  27.76,26.95 270 bottom
C7  11.98,16.81 180 top
C8  22.5,24.06 180 bottom
C9  30.12,14.52 270 bottom
C10  10.16,18 270 bottom
C11  26.97,17 0 bottom
C12  8.07,18 270 bottom
C13  12.38,18 270 bottom
C14  13.96,18 270 bottom
C15  20.44,29 180 bottom
C16  30.05,23.04 0 top
C17  30.05,24.65 0 top
C18  18.96,18 90 bottom
C19  17.39,18 90 bottom
C20  30.05,14.82 180 top
C21  32.69,20.9 90 top
CHG  3.75,9 90 top
CLK  4.78,19.18 270 bottom
D1  12.3,25.28 270 bottom
DISP1  18.25,15 0 top
EN  2.5,17.88 270 bottom
IO  6.22,19.93 270 bottom
JP1  1.75,25 90 bottom
R1  9.2,21.87 0 bottom
R2  3.75,10.7 0 top
R3  24.95,29.5 180 bottom
R4  15.91,26.34 90 top
R6  32.75,10.7 180 top
R7  14.61,25.3 90 bottom
R8  15.56,18 270 bottom
R9  24.24,17 180 bottom
R10  17.27,29 0 bottom
R11  25.45,19.23 270 top
R12  25.45,16.12 90 top
RST  13.75,21.04 0 bottom
RTC1  24.15,20.66 270 bottom
S1  34.25,25.5 270 bottom
S2  34.25,12 270 bottom
S3  2.25,12 90 bottom
SCL  19.25,22.23 0 bottom
SDA  19.25,20.59 180 bottom
U1  18.25,17.12 270 top
U2  24.95,26.95 270 bottom
U3  9.2,24.84 0 bottom
U4  18.75,26.14 270 bottom
U6  34.25,19 0 bottom
U7  30.05,19.42 270 top
X1  12.51,19.54 90 top

### Tracks (layer width: path | path; a pad name or v marks a point on that pad's centre or on a via)
!RESET  (via drill 0.3)
  Top 0.152: v20.35,23.61 20.35,21.89 19.5,21.04 U1.40
  Bottom 0.152: RST.1 16.1,21.04 16.92,21.86 16.92,23.58 17.53,24.18 19.77,24.18 v20.35,23.61
+3V3  (via drill 0.3)
  Top 0.152: U1.17 17.5,12.7 v17.46,12.66 | U1.36 23.48,19.88 v23.59,19.99 | R11.1 25.45,20.52 v25.06,20.9 | v17.5,21.51 U1.44 | U1.6 14.14,17.38 13.7,16.93 13.7,13.07 v13.76,13.01 | R12.1 25.45,12.95 v25.47,12.93 | U7.14 U7.1 28.95,22.68 C16.1 29.4,23.24 C17.1 28.35,24.65 v28.25,24.75 | R4.1 15.91,24.87 v16.22,24.57
  Bottom 0.152: U4.7 15.85,25.14 R7.1 15.97,23.9 v15.99,23.92 | v13.76,13.01 13.7,13.07 DISP1.9 13.7,17.09 C14.2 | v11.55,12.94 11.6,13 DISP1.6 11.6,16.57 C13.2 | U6.6 35.03,18.66 34.67,18.66 34.36,18.97 | 34.36,18.97 34.36,19.67 34.67,19.98 U6.8 | U3.5 10.05,26.24 C3.2 9.85,27.91 C4.2 10.74,29.28 11.22,28.8 v11.22,28.26 v11.21,28.25 | 34.36,18.97 34.36,17.25 v35.09,16.52 | C19.2 17.5,18.77 | 17.5,18.77 v17.5,21.51 | 17.5,18.77 17.62,18.65 C18.2 20.34,20.02 RTC1.6 | +.P$1 5.47,16.75 v5.88,16.75
  pour Route15: -0.25,0 36.75,0 36.75,38 -0.25,38
BIN
  Bottom 0.152: R10.2 15.93,28.31 15.93,26.57 16.16,26.34 U4.10
CS  (via drill 0.3)
  Top 0.152: 16,13.1 U1.14 16,12.85 v15.53,12.38
  Bottom 0.152: DISP1.13 16.5,12.9 15.99,12.39 15.54,12.39 v15.53,12.38
D9  (via drill 0.3)
  Top 0.152: v14.28,12.03 14.78,12.53 U1.12
  Bottom 0.152: S3.2 5.1,12.03 v14.28,12.03
D10  (via drill 0.3)
  Top 0.152: U1.27 22.55,15.38 23.38,14.54 v23.38,12.98
  Bottom 0.152: S2.1 31.39,12.05 24.31,12.05 v23.38,12.98
D12  (via drill 0.3)
  Top 0.152: U1.28 22.63,15.88 23.84,14.66 23.84,12.74 25.15,11.43 30.86,11.43 34.22,14.79 v34.22,24.48
  Bottom 0.152: 33.65,22.11 S1.2 34.2,24.47 v34.22,24.48
D13
  Top 0.152: U1.26 21.73,14.87 22.35,14.87 22.73,14.48 22.73,12.7 26.43,9 13.A
D+  (via drill 0.3)
  Top 0.152: U1.34 23.56,18.88 24.15,19.47 24.15,28.07 23.42,28.8 9.56,28.8 6.11,25.35 v5.71,25.35
  Bottom 0.152: JP1.D+ 4.46,25.07 5.43,25.07 v5.71,25.35
D-  (via drill 0.3)
  Top 0.152: U1.33 23.62,18.38 24.5,19.25 24.5,28.22 23.6,29.11 8.88,29.11 v6.45,26.69
  Bottom 0.152: v6.45,26.69 6.45,25.01 5.79,24.35 JP1.D-
DC  (via drill 0.3)
  Top 0.152: U1.16 17,12.94 16.86,12.8 16.86,12.03 v17.14,11.76
  Bottom 0.152: 17.97,14.73 DISP1.15 17.89,13.13 18.04,12.98 18.04,12.21 17.58,11.76 v17.14,11.76
EN
  Bottom 0.152: U3.3 8.25,22.17 R1.2 7.74,21.87 7.54,21.67 7.54,21.28 7.24,20.97 5.88,20.97 5.62,21.22 4.84,21.22 3.27,19.66 2.64,19.66 2.49,19.5 EN.1
GND  (via drill 0.3)
  Top 0.152: U7.7 30.05,16 | 32.52,18.97 31.19,18.97 U7.10 U7.11
  Bottom 0.152: U4.EP3 19.86,24.75 20.5,24.75 | U6.7 35.22,19.32 35.55,19.65 35.55,20.26 35.29,20.51 33.64,20.51 33.45,20.32 U6.1 33.45,21.3 | C15.1 19.85,28.95 U4.EP2 19.85,26.34 U4.3 | R10.1 17.65,28.73 U4.EP1 17.65,26.34 | 16.88,24.75 17.65,24.75 U4.EP4 17.65,26.34 | U4.EP 18.75,26.34 17.65,26.34
  other vias: 6.33,14.06 31.86,14.91 28.01,23.45 10.99,26.25 26.48,24.55 28.33,29.98 34.41,26.58 29.15,10.43 20.38,10.88 13.63,10.02 4.85,29.51 7.01,28.74 23.5,25.25 2.36,12.62 3.74,22.25 31.49,16.12
  pour Top: -0.25,0 36.75,0 36.75,38 -0.25,38
  pour Route2: -0.25,0 36.75,0 36.75,38 -0.25,38
  pour Bottom: 36.75,0 36.75,38 -0.25,38 -0.25,0
INT1
  Top 0.152: U1.29 22.8,16.38 24.33,14.85 24.33,12.83 25.35,11.8 26.47,11.8 27.52,12.85 27.52,17.86 27.88,18.22 U7.5
INT2
  Top 0.152: U1.30 23,16.88 24.73,15.14 24.73,12.96 25.55,12.15 26.26,12.15 27.22,13.11 27.22,18.44 27.79,19.02 U7.4
MOSI  (via drill 0.3)
  Top 0.152: v20.67,12.39 20.33,12.04 19.03,12.04 18.5,12.57 U1.19
  Bottom 0.152: DISP1.19 20.67,14.77 v20.67,12.39
N$1
  Bottom 0.152: DISP1.11 15.1,16.89 R8.2
N$2  (via drill 0.33)
  other vias: 17.99,26.7
N$3  (via drill 0.33)
  other vias: 18.75,26.7
N$4
  Bottom 0.152: U4.5 21.64,25.54 21.97,25.88 21.97,28.69 21.66,29 C15.2
N$5  (via drill 0.33)
  other vias: 19.51,26.7
N$6  (via drill 0.33)
  other vias: 17.99,25.69
N$7  (via drill 0.33)
  other vias: 18.75,25.69
N$8  (via drill 0.33)
  other vias: 19.51,25.69
N$9
  Top 0.152: U1.1 13.38,19.88 X1.P$1 10.59,20.74 C5.1
N$10
  Top 0.152: U1.2 13.55,19.38 X1.P$2 12.63,18.22 C7.1
N$11
  Top 0.152: R2.1 2.7,10.3 CHG.C
N$12
  Top 0.152: U7.6 28.95,15.27 C20.2
N$13
  Top 0.152: U7.12 32.32,20.62 C21.1
N$14
  Top 0.152: C21.2 32.55,21.42 U7.13
N$15  (via drill 0.3)
  Top 0.152: R4.2 15.91,27.66 16.2,27.95 16.71,27.95 v16.76,27.89
  Bottom 0.152: v16.76,27.89 16.76,27.15 U4.12
N$16
  cutout Route2: 28.25,22.25 31.88,22.25 31.88,16.55 28.25,16.55
  cutout Route15: 28.25,22.25 31.88,22.25 31.88,16.55 28.25,16.55
N$17
  Top 0.152: R6.1 33.8,10.3 13.C
N$34
  Bottom 0.152: R9.2 25.6,16.29 DISP1.26
N$35
  Bottom 0.152: C12.2 8.8,16.62 DISP1.2
N$36
  Bottom 0.152: C12.1 9.3,17.42 9.3,16.66 9.5,16.45 DISP1.3
N$37
  Bottom 0.152: C10.2 10.2,17.3 DISP1.4
N$38
  Bottom 0.152: C10.1 10.9,17.9 DISP1.5
N$39
  Bottom 0.152: C9.2 29.42,12.97 27.36,12.97 27,13.34 DISP1.28
N$40
  Bottom 0.152: C11.2 26.32,14.82 DISP1.27
PROG
  Bottom 0.152: R3.1 23.57,28.81 U2.5
RES  (via drill 0.3)
  Top 0.152: U1.15 16.5,12.01 v16.17,11.68
  Bottom 0.152: v16.17,11.68 16.9,12.41 16.9,12.95 17.2,13.25 DISP1.14
SCK  (via drill 0.3)
  Top 0.152: U1.20 19,12.93 v19.34,12.59
  Bottom 0.152: DISP1.18 20,12.74 19.86,12.6 19.35,12.6 v19.34,12.59
SCL  (via drill 0.3)
  Top 0.152: U1.32 24.75,17.88 R11.2 25.49,18.62 26.07,18.62 26.57,19.12 26.57,19.88 | v21.38,27.78 21.04,27.44 21.04,25.06 19.55,23.57 v19.55,23.46 | 26.57,19.88 26.57,23.09 v27.26,23.78 27.26,24.65 28.27,25.66 31.99,25.66 33.74,23.91 33.74,17.6 v32.69,16.56 | U7.2 27.3,20.62 26.57,19.88
  Bottom 0.152: v19.55,23.46 19.25,23.16 SCL.P$1 19.59,22.57 RTC1.8 25,22.57 26.22,23.78 v27.26,23.78 | U4.2 21.39,26.74 21.56,26.92 21.56,27.6 v21.38,27.78 | U6.4 32.97,18.02 32.69,17.75 v32.69,16.56
SDA  (via drill 0.3)
  Top 0.152: U7.3 27.39,19.82 26.92,19.35 26.92,17.57 | 26.92,17.57 26.12,16.77 R12.2 24.84,17.38 24.84,17.37 v22.56,17.37 v22.56,17.38 U1.31 | v33.47,16.38 33.47,15.11 v31.64,13.28 | v26.29,12.95 26.92,13.58 26.92,17.57 | v18.66,23.68 20.57,25.58 v20.57,27.91
  Bottom 0.152: v18.66,23.68 18.56,23.68 18.05,23.17 18.05,21.35 18.81,20.59 SDA.P$1 19.95,21.3 RTC1.7 23.82,21.3 24.23,20.88 24.23,19.04 v22.56,17.37 | U6.3 33.92,18.67 34.04,18.55 34.04,16.67 33.75,16.38 v33.47,16.38 | U4.1 20.57,27.14 v20.57,27.91 | v31.64,13.28 30.87,12.51 26.41,12.51 26.29,12.63 v26.29,12.95
STAT  (via drill 0.3)
  Top 0.152: v26.76,29.22 26.32,29.66 6.81,29.66 4.4,27.25 R2.2
  Bottom 0.152: U2.1 26.76,28.41 v26.76,29.22
SWCLK  (via drill 0.3)
  Top 0.152: v5.23,20.55 7.25,22.57 16.35,22.57 16.83,22.08 16.83,21.37 17,21.2 U1.45
  Bottom 0.152: CLK.P$1 4.78,20.1 v5.23,20.55
SWDIO  (via drill 0.3)
  Top 0.152: v7.79,20.63 9.31,22.15 16,22.15 16.5,21.65 U1.46
  Bottom 0.152: IO.P$1 6.93,20.63 v7.79,20.63
VBAT
  Bottom 0.152: U4.8 15.76,25.54 R7.2 | R7.2 15.34,27.43 | D1.A 12.3,24.4 14.6,26.7 R7.2 | R7.2 14.61,28.52 15.91,29.82 21.68,29.82 22.35,29.16 22.35,25.45 22.65,25.14 | 22.65,25.14 U4.6 | 22.65,25.14 23.15,24.64 C8.2 24.93,24.06 26.17,25.3 26.17,25.99 U2.3 27.61,26 C6.2 29.35,26.1 BAT+.P$1
VBUS  (via drill 0.3)
  Top 0.152: v9.17,20.41 8.76,20 6.25,20 4.8,18.55 4.8,11.96 5.17,11.59 5.17,9 CHG.A
  Bottom 0.152: JP1.VBUS 4.49,23.61 C2.2 7.61,24.78 9.89,24.78 10.15,24.52 | 10.15,24.52 U3.1 10.15,22.17 R1.1 9.85,21.09 v9.17,20.41 | 10.15,24.52 11.02,24.52 12.3,25.8 D1.C 12.3,27.75 12.83,28.27 13.85,28.27 15.86,30.28 21.93,30.28 22.68,29.54 22.68,26.89 U2.4
VDDCORE1
  Top 0.152: 18,22.43 C1.2 18.13,22.33 18.13,21.16 18,21.04 U1.43

### Text on the board
tNames: CUT OUT | CUT OUT
bNames: RWatch | Rev. A - OCT 2016 | Designed by R.R. In Switzerland
Measures: OLED: x:18.5 y:14
Document: TRACE: 6mil DRILL: 12mil